# EAGLE schematic focuser-no-jumper (EAGLE 6.3)
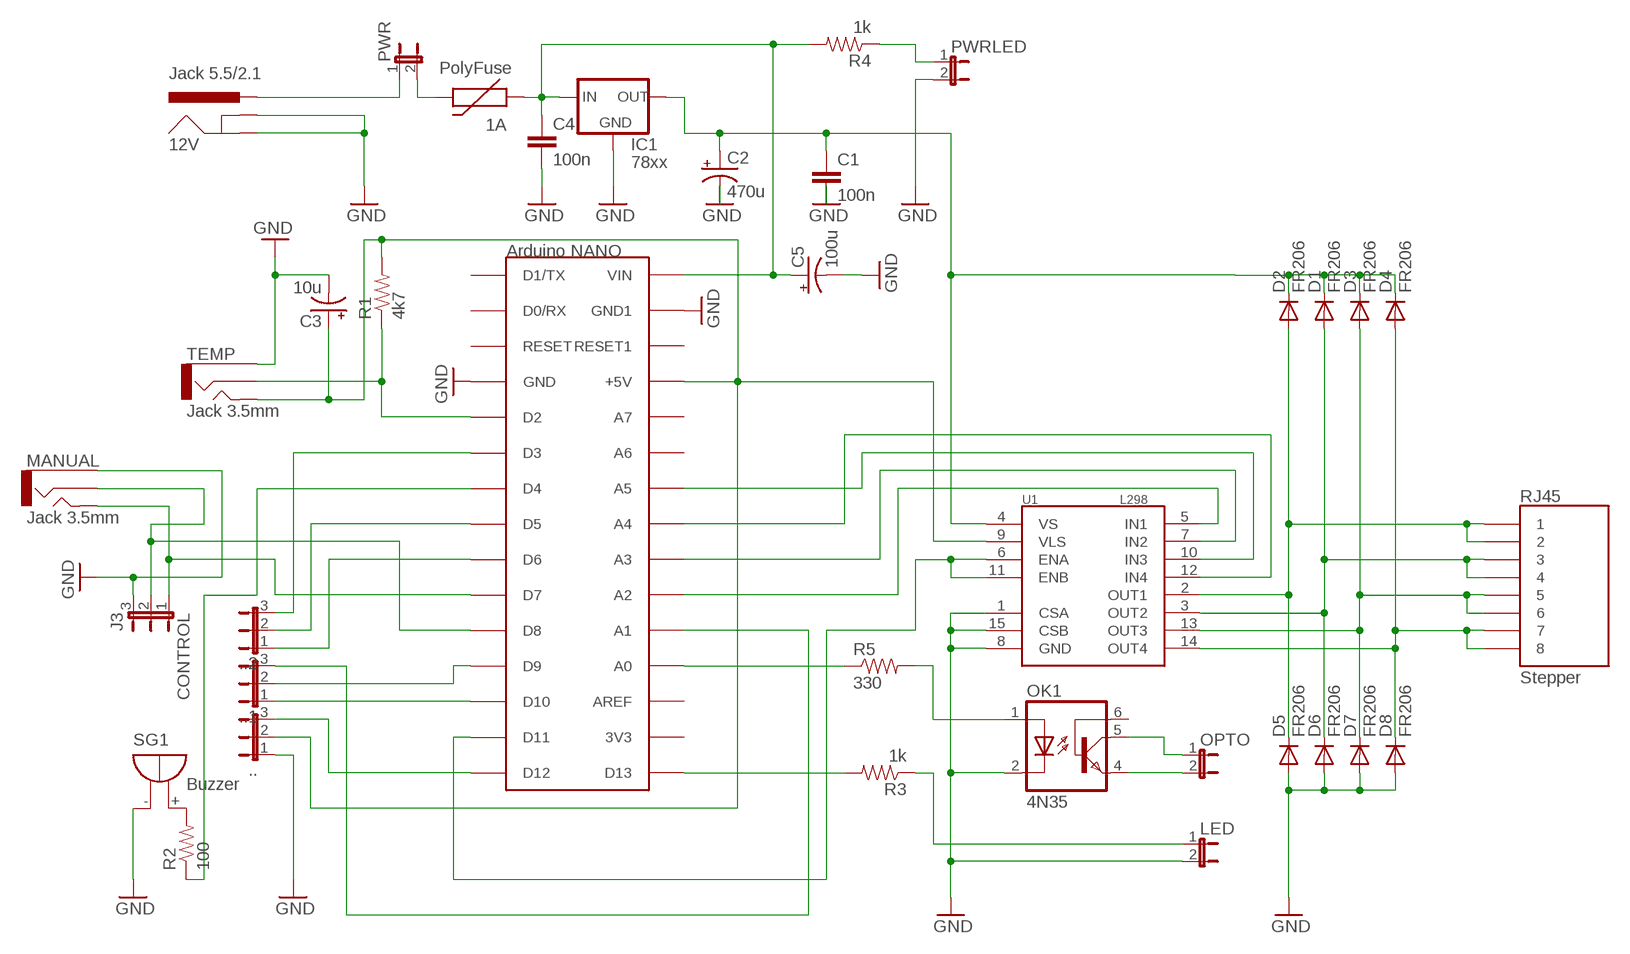
[diagram p0: schematic, sheet 1]

## Parts
1A  PolyFuse  PTCPTH  [PTC]
12V  Jack 5.5/2.1  POWER_JACKCOMBO  [POWER_JACK_COMBO]
..  JUMPER-3PTH  [1X03]
..1  JUMPER-3PTH  [1X03]
..2  JUMPER-3PTH  [1X03]
C1  100n  CAP_  [AXIAL-5MM]
C2  470u  CAP_POLPTH1  [CPOL-RADIAL-100UF-25V]
C3  10u  CAP_POLPTH1  [CPOL-RADIAL-100UF-25V]
C4  100n  CAP_  [AXIAL-5MM]
C5  100u  CAP_POLPTH1  [CPOL-RADIAL-100UF-25V]
CONTROL  J3  JUMPER-3PTH  [1X03]
D1  FR206  1N4004  [DO41-10]
D2  FR206  1N4004  [DO41-10]
D3  FR206  DIODEPTH  [DIODE-1N4001]
D4  FR206  DIODEPTH  [DIODE-1N4001]
D5  FR206  DIODEPTH  [DIODE-1N4001]
D6  FR206  DIODEPTH  [DIODE-1N4001]
D7  FR206  DIODEPTH  [DIODE-1N4001]
D8  FR206  DIODEPTH  [DIODE-1N4001]
IC1  78xx  V_REG_78XXSINK  [TO220-IGO]
LED  JUMPER-2PTH  [1X02]
MANUAL  Jack 3.5mm  AUDIO-JACKPTH  [AUDIO-JACK]
NANO  MMduino  ARDUINONANO  [PDIP-32]
OK1  4N35  [DIL06]
OPTO  JUMPER-2PTH  [1X02]
PWR  JUMPER-2PTH  [1X02]
PWRLED  JUMPER-2PTH  [1X02]
R1  4k7  RESISTORPTH1  [AXIAL-0.3]
R2  100  RESISTORPTH1  [AXIAL-0.3]
R3  1k  RESISTORPTH1  [AXIAL-0.3]
R4  1k  RESISTORPTH1  [AXIAL-0.3]
R5  330  RESISTORPTH1  [AXIAL-0.3]
RJ45  Stepper  RJ45-8PTH  [RJ45-8]
SG1  Buzzer  F/QMBIII  [F/QMBIII]
TEMP  Jack 3.5mm  AUDIO-JACKPTH  [AUDIO-JACK]
U1  L298  [MULTIWATT15]

## Nets
+5: ...2 C3.1(+) NANO.+5V R1.P$2 TEMP.5 U1.9(VLS)
GND [power]: 12V.GND(GNDBREAK) 12V.GND@1(GND) ...1 C1.P$2 C2.2(-) C3.2(-) C4.P$2 C5.2(-) CONTROL.3 D5.A D6.A D7.A D8.A IC1.GND LED.2 MANUAL.1 NANO.GND NANO.GND1 OK1.2(C) PWRLED.2 SG1.-(+) TEMP.1 U1.1(CSA) U1.8(GND) U1.15(CSB)
N$1: LED.1 R3.P$1
N$2: CONTROL.1 MANUAL.5 NANO.D7
N$4: NANO.A5(A2) U1.5(IN1)
N$5: NANO.A4(A3) U1.7(IN2)
N$7 [power]: 1A.P$2 PWR.2
N$8 [power]: CONTROL.2 MANUAL.2 NANO.D8
N$10 [power]: D4.A D8.C RJ45.7 RJ45.8 U1.14(OUT4)
N$12: NANO.A7(A0) R5.P$1
N$13: NANO.A2(A5) U1.10(IN3)
N$14 [power]: D1.A D6.C RJ45.3 RJ45.4 U1.3(OUT2)
N$15: NANO.A3(A4) U1.12(IN4)
N$16 [power]: D2.A D5.C RJ45.1 RJ45.2 U1.2(OUT1)
N$18: ..1.2 NANO.D9
N$19: NANO.D2 R1.P$1 TEMP.2
N$20 [power]: PWRLED.1 R4.P$1
N$21 [power]: D3.A D7.C RJ45.5 RJ45.6 U1.13(OUT3)
N$24: R2.P$2 SG1.+(-)
N$25: ...3 NANO.D12
N$28: NANO.D13 R3.P$2
N$30: 12V.POWER(PWR) PWR.1
N$31: ..1.1 NANO.D10
N$32: ..2.3 NANO.D3
N$33: NANO.D4 R2.P$1
N$34: ..2.2 NANO.D5
N$35: ..2.1 NANO.D6
N$37: OK1.1(A) R5.P$2
N$38: OK1.4(EMI) OPTO.2
N$39: OK1.5(COL) OPTO.1
N$42: NANO.D11 U1.6(ENA) U1.11(ENB)
N$43: ..1.3 NANO.A6(A1)
N$44 [power]: 1A.P$1 C4.P$1 C5.1(+) IC1.IN NANO.VIN R4.P$2
VCC2 [power]: C1.P$1 C2.1(+) D1.C D2.C D3.C D4.C IC1.OUT U1.4(VS)
Unconnected: NANO.3V3 NANO.A0(A7) NANO.A1(A6) NANO.AREF NANO.D0/RX NANO.D1/TX NANO.RESET NANO.RESET1 OK1.6(BAS)

## Library data of the parts
1A = SparkFun:PTC: Resettable Fuse PTC Resettable Fuse. Spark Fun Electronics SKU : COM-08357
12V = SparkFun:POWER_JACK: Power Jack This is the standard 5.5mm barrel jack for power. The PTH is the most common, proven, reliable, footprint. All others are experimental. The Slot footprint only works if the mill layer is transmitted to the PCB fab house so be warned. Spark Fun Electronics SKU : PRT-00119. Mating wall wart : TOL-00298 (and others)
.. ..1 ..2 CONTROL = SparkFun:JUMPER-3
C1 C4 = SparkFun:CAP: Capacitor Standard 0603 ceramic capacitor, and 0.1" leaded capacitor.
C2 C3 C5 = SparkFun:CAP_POL: Capacitor Polarized These are standard SMD and PTH capacitors. Normally 10uF, 47uF, and 100uF in electrolytic and tantalum varieties. Always verify the external diameter of the through hole cap, it varies with capacity, voltage, and manufacturer. The EIA devices should be standard.
D1 D2 = diode:1N4004: DIODE general purpose rectifier, 1 A
D3-D8 = SparkFun:DIODE: Diode These are standard reverse protection diodes and small signal diodes. SMA package can handle up to about 1A. SOD-323 can handle about 200mA. What the SOD-323 package when ordering, there are some mfgs out there that are 5-pin packages.
IC1 = SparkFun:V_REG_78XX: Voltage Regulator Standard 7805 5V regulator. IGO (Input Ground Output). Spark Fun Electronics SKU : COM-00107
LED OPTO PWR PWRLED = SparkFun:JUMPER-2: Jumper Basic 0.1" spaced jumper. Use with breakaway headers.
MANUAL TEMP = SparkFun:AUDIO-JACK: 3.5mm Audio Jack Simple 3.5mm common PCB mount audio jack. SKU: PRT-08032
NANO = jet-lib:ARDUINONANO; NAM: Arduino NANO
OK1 = optocoupler:4N35: MOTOROLA OPTO COUPLER; MF: FAIRCHILD SEMICONDUCTOR; MPN: 4N35; OC_FARNELL: 1328375; OC_NEWARK: 72K9946
R1-R5 = SparkFun:RESISTOR: Resistor Basic schematic elements and footprints for 0603, 1206, and PTH 1/10th watt (small) resistors.
RJ45 = SparkFun:RJ45-8: RJ45 Jack Simple RJ45, 8-pin connection - connector for common Cat5, Cat5e, and Cat6 Ethernet cables. Footprint not yet proven in production. Connector sku is PRT-00643; Breakout PCB sku is BOB-00716.
SG1 = buzzer2:F/QMBIII: BUZZER Source: Buerklin; OC_FARNELL: unknown; OC_NEWARK: unknown
U1 = SparkFun:L298: L298 Dual Full Bridge Driver

## Net classes
0 default: width 0.254 mm, drill 0.635 mm, clearance 0.203 mm
1 power: width 0.254 mm, drill 0.635 mm, clearance 0.203 mm